# Altium project DM1092_R2M2E2.PrjPcb (part 4 of 5)

## Sheet DM1092_ESP32.SchDoc: =project_title
size Tabloid; CompanyName: Luxonis Holding; DrawnBy: David Malovrh; Organization: Luxonis Holding; Address1: 1925 Harmony Park Drive; Address2: Westminster, CO; Address3: 80234; Address4: United States; DocumentNumber: DXXXX; Revision: R2M2E2; SheetNumber: 9; SheetTotal: 12
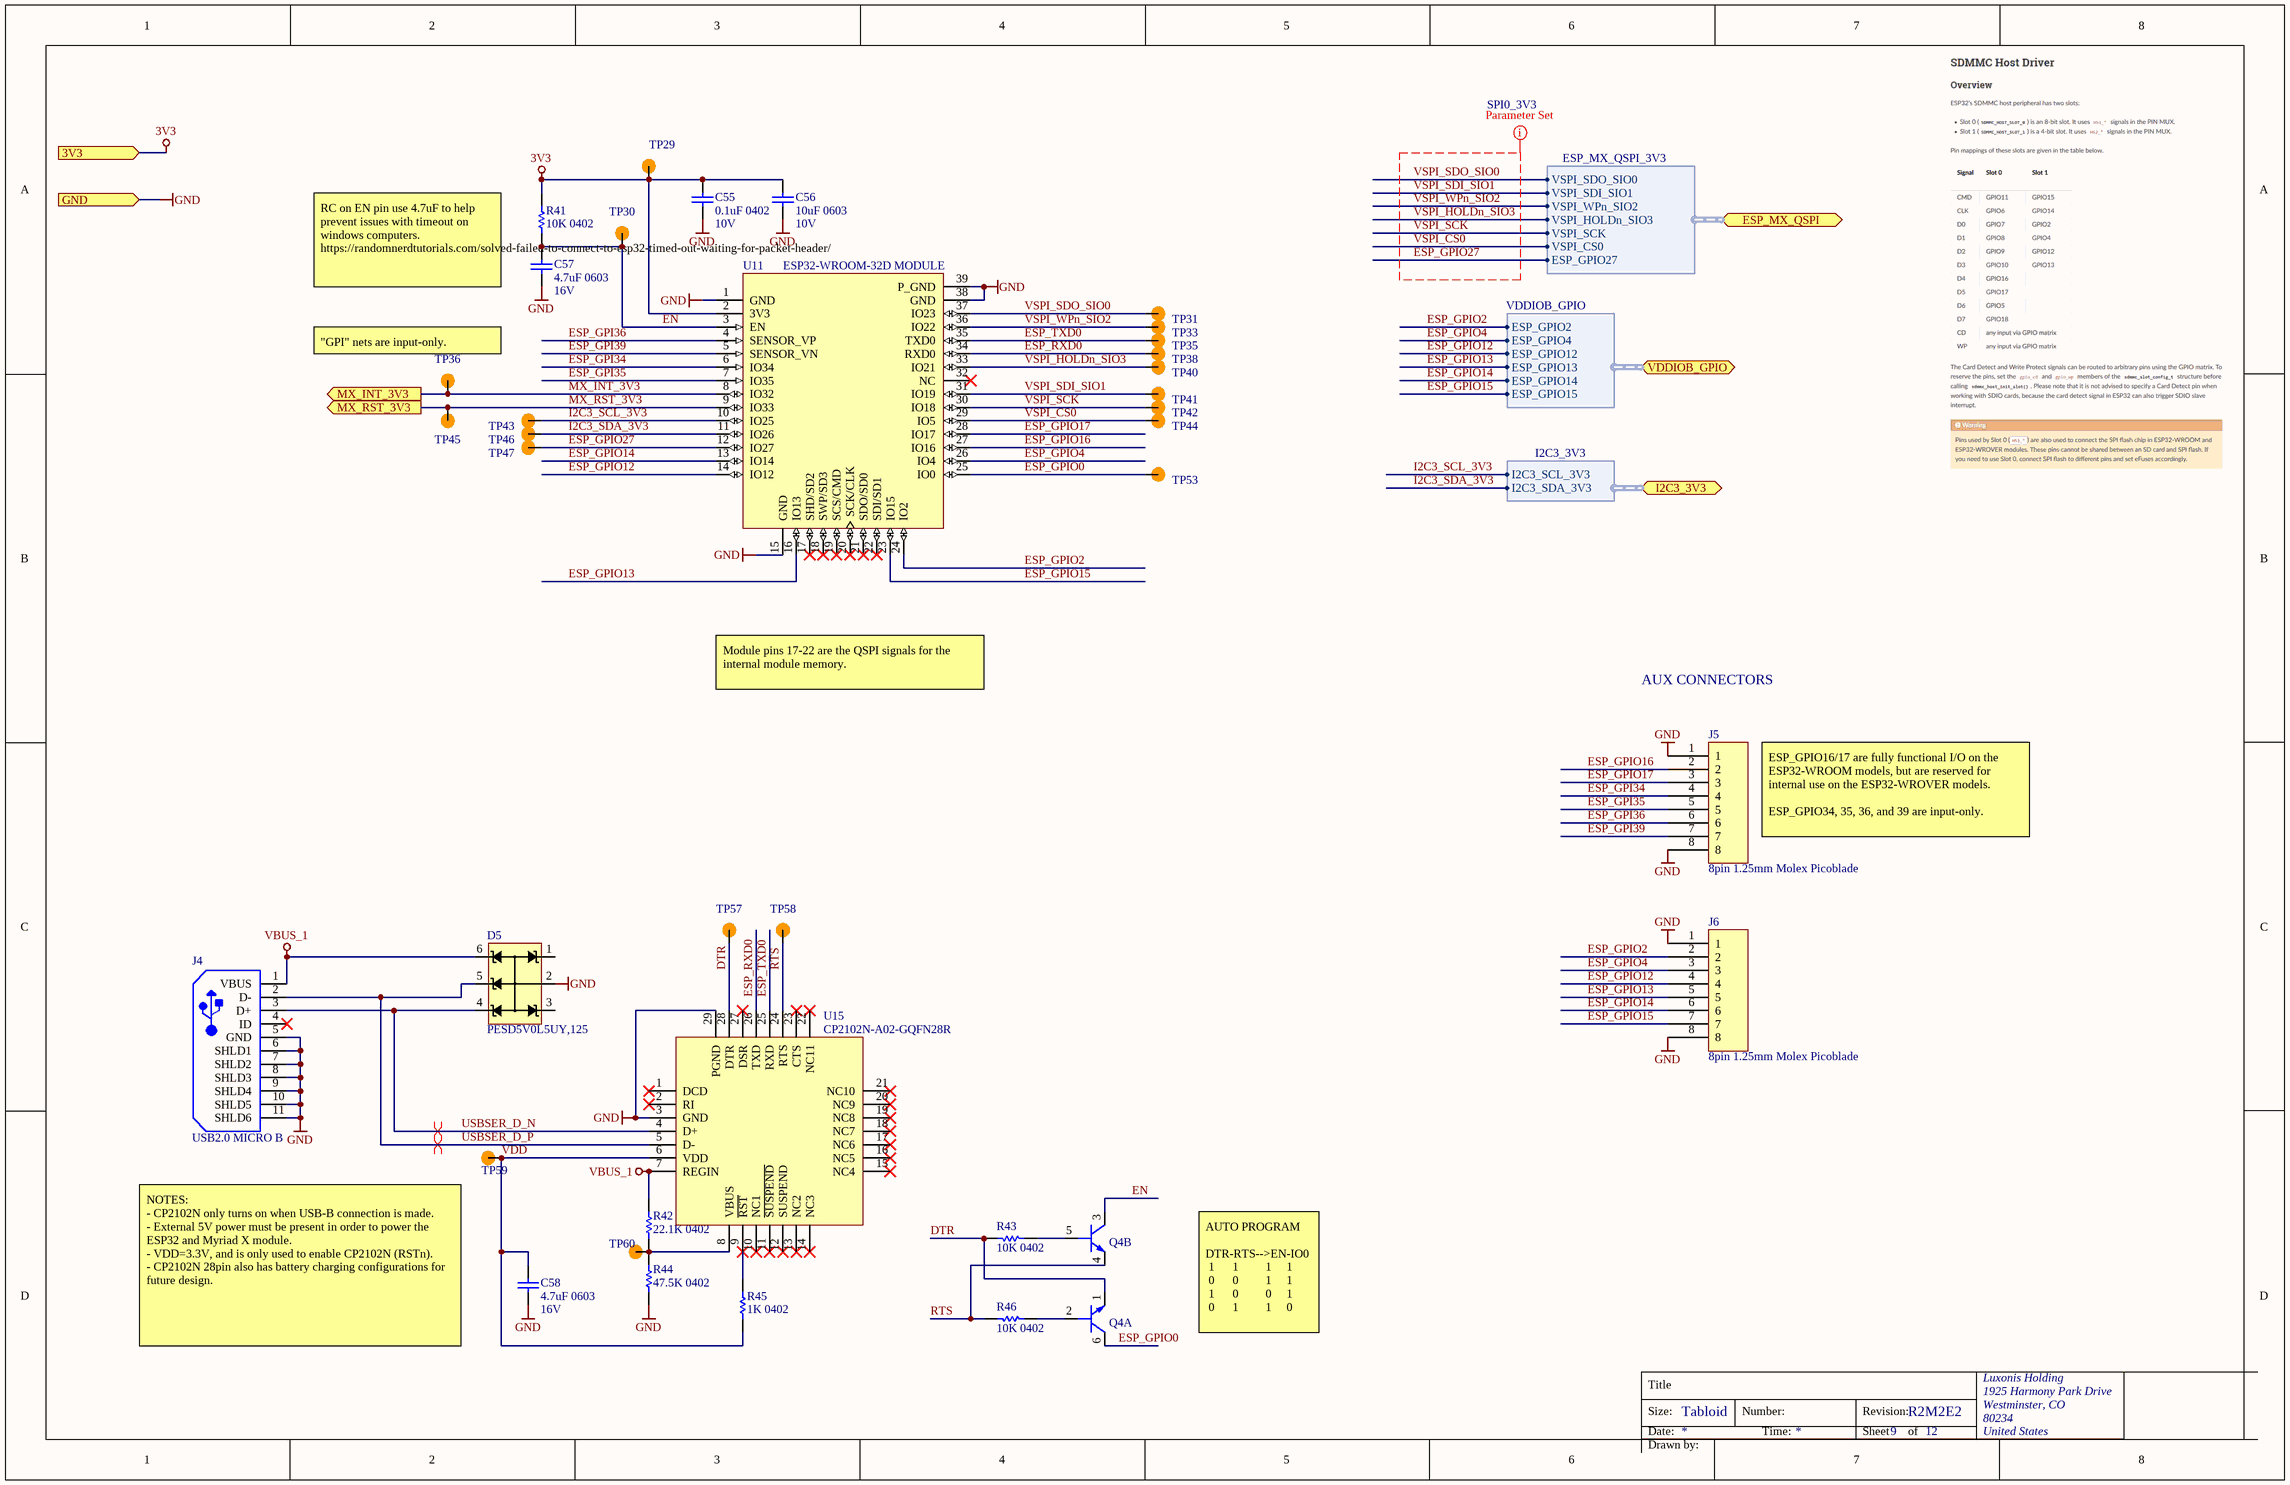
[diagram p5: DM1092_ESP32.SchDoc]

### Parts
C55  0.1uF 0402  Voltage Rating: 10V  [CAPC0402(1005)70_N]
C56  10uF 0603  Voltage Rating: 10V  [CAPC0603(1608)100_N]
C57  4.7uF 0603  Voltage Rating: 16V  [CAPC0603(1608)100_N]
C58  4.7uF 0603  Voltage Rating: 16V  [CAPC0603(1608)100_N]
D5  PESD5V0L5UY,125  [PESD5V0L5UY,125]
J4  USB2.0 MICRO B  [10118192-0001LF]
J5  8pin 1.25mm Molex Picoblade  [53047-0810]
J6  8pin 1.25mm Molex Picoblade  [53047-0810]
Q4  BC847S  [BC847S]  (value not drawn)  (parts A,B of 2)
R41  10K 0402  [RESC0402(1005)_N]
R42  22.1K 0402  [RESC0402(1005)_N]
R43  10K 0402  [RESC0402(1005)_N]
R44  47.5K 0402  [RESC0402(1005)_N]
R45  1K 0402  [RESC0402(1005)_L]
R46  10K 0402  [RESC0402(1005)_N]
TP29  TP100_200_NS  [TP100_200_NS]  (value not drawn)  (no BOM)
TP30  TP100_200_NS  [TP100_200_NS]  (value not drawn)  (no BOM)
TP31  TP100_200_NS  [TP100_200_NS]  (value not drawn)  (no BOM)
TP33  TP100_200_NS  [TP100_200_NS]  (value not drawn)  (no BOM)
TP35  TP100_200_NS  [TP100_200_NS]  (value not drawn)  (no BOM)
TP36  TP100_200_NS  [TP100_200_NS]  (value not drawn)  (no BOM)
TP38  TP100_200_NS  [TP100_200_NS]  (value not drawn)  (no BOM)
TP40  TP100_200_NS  [TP100_200_NS]  (value not drawn)  (no BOM)
TP41  TP100_200_NS  [TP100_200_NS]  (value not drawn)  (no BOM)
TP42  TP100_200_NS  [TP100_200_NS]  (value not drawn)  (no BOM)
TP43  TP100_200_NS  [TP100_200_NS]  (value not drawn)  (no BOM)
TP44  TP100_200_NS  [TP100_200_NS]  (value not drawn)  (no BOM)
TP45  TP100_200_NS  [TP100_200_NS]  (value not drawn)  (no BOM)
TP46  TP100_200_NS  [TP100_200_NS]  (value not drawn)  (no BOM)
TP47  TP100_200_NS  [TP100_200_NS]  (value not drawn)  (no BOM)
TP53  TP100_200_NS  [TP100_200_NS]  (value not drawn)  (no BOM)
TP57  TP100_200_NS  [TP100_200_NS]  (value not drawn)  (no BOM)
TP58  TP100_200_NS  [TP100_200_NS]  (value not drawn)  (no BOM)
TP59  TP100_200_NS  [TP100_200_NS]  (value not drawn)  (no BOM)
TP60  TP100_200_NS  [TP100_200_NS]  (value not drawn)  (no BOM)
U11  ESP32-WROOM-32D MODULE  [ESP32-WROOM/WROVER Combo]
U15  CP2102N-A02-GQFN28R  [CP2102N-A02-GQFN28R]

### Ports
3V3 (in), ESP_MX_QSPI (bidir, harness ESP_MX_QSPI_3V3), GND (in), I2C3_3V3 (bidir, harness I2C3_3V3), MX_INT_3V3 (out), MX_RST_3V3 (out), VDDIOB_GPIO (bidir, harness VDDIOB_GPIO)

### Harnesses
VDDIOB_GPIO: ESP_GPIO2, ESP_GPIO4, ESP_GPIO12, ESP_GPIO13, ESP_GPIO14, ESP_GPIO15
I2C3_3V3: I2C3_SCL_3V3, I2C3_SDA_3V3
ESP_MX_QSPI_3V3: VSPI_CS0, VSPI_HOLDn_SIO3, VSPI_SCK, VSPI_SDI_SIO1, VSPI_SDO_SIO0, VSPI_WPn_SIO2, ESP_GPIO27

### Nets
3V3: C55.2 C56.2 R41.2 TP29.1 U11.2(3V3) ; port 3V3
GND: C55.1 C56.1 C57.1 C58.1 D5.2 J4.5(GND) J4.6(SHLD1) J4.7(SHLD2) J4.8(SHLD3) J4.9(SHLD4) J4.10(SHLD5) J4.11(SHLD6) J5.1 J5.8 J6.1 J6.8 R44.1 U11.1(GND) U11.15(GND) U11.38(GND) U11.39(P_GND) U15.3(GND) U15.29(PGND) ; port GND
VBUS_1: D5.6 J4.1(VBUS) R42.1 U15.7(REGIN)
DTR: Q4.1(E1) R43.1 TP57.1 U15.28(DTR)
EN: C57.2 Q4.3(C2) R41.1 TP30.1 U11.3(EN)
ESP_GPI34: J5.4 U11.6(IO34)
ESP_GPI35: J5.5 U11.7(IO35)
ESP_GPI36: J5.6 U11.4(SENSOR_VP)
ESP_GPI39: J5.7 U11.5(SENSOR_VN)
ESP_GPIO0: Q4.6(C1) TP53.1 U11.25(IO0)
ESP_GPIO2: J6.2 U11.24(IO2) ; port VDDIOB_GPIO.ESP_GPIO2
ESP_GPIO4: J6.3 U11.26(IO4) ; port VDDIOB_GPIO.ESP_GPIO4
ESP_GPIO12: J6.4 U11.14(IO12) ; port VDDIOB_GPIO.ESP_GPIO12
ESP_GPIO13: J6.5 U11.16(IO13) ; port VDDIOB_GPIO.ESP_GPIO13
ESP_GPIO14: J6.6 U11.13(IO14) ; port VDDIOB_GPIO.ESP_GPIO14
ESP_GPIO15: J6.7 U11.23(IO15) ; port VDDIOB_GPIO.ESP_GPIO15
ESP_GPIO16: J5.2 U11.27(IO16)
ESP_GPIO17: J5.3 U11.28(IO17)
ESP_GPIO27: TP47.1 U11.12(IO27) ; port ESP_MX_QSPI.ESP_GPIO27
ESP_RXD0: TP38.1 U11.34(RXD0) U15.26(TXD)
ESP_TXD0: TP35.1 U11.35(TXD0) U15.25(RXD)
I2C3_SCL_3V3: TP43.1 U11.10(IO25) ; port I2C3_3V3.I2C3_SCL_3V3
I2C3_SDA_3V3: TP46.1 U11.11(IO26) ; port I2C3_3V3.I2C3_SDA_3V3
MX_INT_3V3: TP36.1 U11.8(IO32) ; port MX_INT_3V3
MX_RST_3V3: TP45.1 U11.9(IO33) ; port MX_RST_3V3
RTS: Q4.4(E2) R46.2 TP58.1 U15.24(RTS)
USBSER_D_N: D5.4 J4.3(D+) U15.4(D+)
USBSER_D_P: D5.5 J4.2(D-) U15.5(D-)
VDD: C58.2 R45.1 TP59.1 U15.6(VDD)
VSPI_CS0: TP44.1 U11.29(IO5) ; port ESP_MX_QSPI.VSPI_CS0
VSPI_HOLDn_SIO3: TP40.1 U11.33(IO21) ; port ESP_MX_QSPI.VSPI_HOLDn_SIO3
VSPI_SCK: TP42.1 U11.30(IO18) ; port ESP_MX_QSPI.VSPI_SCK
VSPI_SDI_SIO1: TP41.1 U11.31(IO19) ; port ESP_MX_QSPI.VSPI_SDI_SIO1
VSPI_SDO_SIO0: TP31.1 U11.37(IO23) ; port ESP_MX_QSPI.VSPI_SDO_SIO0
VSPI_WPn_SIO2: TP33.1 U11.36(IO22) ; port ESP_MX_QSPI.VSPI_WPn_SIO2
NetQ4_2: Q4.2(B1) R46.1
NetQ4_5: Q4.5(B2) R43.2
NetR42_2: R42.2 R44.2 TP60.1 U15.8(VBUS)
NetR45_2: R45.2 U15.9(~{RST})

Not connected (* = marked no-connect by the designer): D5 1 3; J4 4(ID)*; U11 17(SHD/SD2)* 18(SWP/SD3)* 19(SCS/CMD)* 20(SCK/CLK)* 21(SDO/SD0)* 22(SDI/SD1)* 32(NC)*; U15 1(DCD)* 2(RI)* 10(NC1)* 11(~{SUSPEND})* 12(SUSPEND)* 13(NC2)* 14(NC3)* 15(NC4)* 16(NC5)* 17(NC6)* 18(NC7)* 19(NC8)* 20(NC9)* 21(NC10)* 22(NC11)* 23(CTS)* 27(DSR)*

### Layout directives
differential pair; differential pair class USB3: USBSER_D_N, USBSER_D_P
net class SPI0_3V3; rule Matched Net Lengths [Delay Tolerance = 50ps]: ESP_GPIO27, VSPI_CS0, VSPI_HOLDn_SIO3, VSPI_SCK, VSPI_SDI_SIO1, VSPI_SDO_SIO0, VSPI_WPn_SIO2

### Notes on the sheet
- RC on EN pin use 4.7uF to help prevent issues with timeout on windows computers. https://randomnerdtutorials.com/solved-failed-to-connect-to-esp32-timed-out-waiting-for-packet-header/
- (near TP36) "GPI" nets are input-only.
- Module pins 17-22 are the QSPI signals for the internal module memory.
- AUX CONNECTORS
- ESP_GPIO16/17 are fully functional I/O on the ESP32-WROOM models, but are reserved for internal use on the ESP32-WROVER models.
  ESP_GPIO34, 35, 36, and 39 are input-only.
- (near TP59) NOTES:
  - CP2102N only turns on when USB-B connection is made.
  - External 5V power must be present in order to power the ESP32 and Myriad X module.
  - VDD=3.3V, and is only used to enable CP2102N (RSTn).
  - CP2102N 28pin also has battery charging configurations for future design.
- AUTO PROGRAM
  DTR-RTS-->EN-IO0
  1      1         1     1
  0      0         1     1
  1      0         0     1
  0      1         1     0
- Title
- Size:
- Date:
- Tabloid
- Number:
- Time:
- Revision:
- Sheet
- of
- Drawn by:

### Library data of the parts
C55 = GRM155R71A104JA01D: CAP CER 0.1UF 10V X7R 0402 5%; Manufacturer 1: Murata; Capacitance: 100nF; Supplier 1: Digi-Key; Manufacturer Part Number 1: GRM155R71A104JA01D; Stock 1: 1346709; Pricing 1: 1=0.10000, 10=0.02500, 100=0.01130, 500=0.00806, 1000=0.00633, 2500=0.00575, 5000=0.00529 (USD); RoHS: Yes; Mount: Surface Mount; Case/Package: 0402; Case Code (Imperial): 0402; Case Code (Metric): 1005; Min Operating Temperature: -55°C; Max Operating Temperature: 125°C; Tolerance: 5%; Packaging: Tape and Reel; Voltage Rating (DC): 10V; Dielectric: X7R; Package Quantity: 10000; Termination: SMD/SMT; Length: 1mm; Height: 0.5mm; Width: 0.02inch; Thickness: 0.022inch; Depth: 0.5mm; Radiation Hardening: No; Lead Free: Lead Free; ComponentLink1URL: https://datasheet.ciiva.com/5411/product-5411135.pdf?src-supplier=Mouser; ComponentLink1Description: https://datasheet.ciiva.com/5411/product-5411135.pdf?src-supplier=Mouser; ComponentLink2URL: https://datasheet.ciiva.com/11618/c02e-11618821.pdf?src-supplier=Avnet; ComponentLink2Description: https://datasheet.ciiva.com/11618/c02e-11618821.pdf?src-supplier=Avnet; Supplier Part Number 1: 490-10777-1-ND
C56 = GRM188R61A106ME69D: CAP CER 10UF 10V X5R 0603 20%; Manufacturer 1: Murata; Material: Ceramic; Supplier 1: Digi-Key; Manufacturer Part Number 1: GRM188R61A106ME69D; Stock 1: 2873098; Pricing 1: 1=0.21000, 10=0.14100, 100=0.07130, 500=0.04876, 1000=0.04313 (USD); RoHS: Yes; Mount: Surface Mount; Case/Package: 0603; Weight: 0.000222oz; Case Code (Metric): 1608; Case Code (Imperial): 0603; Min Operating Temperature: -55°C; Max Operating Temperature: 85°C; Packaging: Tape and Reel; Tolerance: 20%; Capacitance: 10uF; Dielectric: X5R; Voltage Rating (DC): 10V; Package Quantity: 4000; Termination: SMD/SMT; Length: 1.6mm; Height: 0.8mm; Width: 0.8mm; Thickness: 0.035inch; Depth: 0.8mm; REACH SVHC: Unknown; Lead Free: Lead Free; ComponentLink1URL: http://www.mouser.com/ds/2/281/c02e-2905.pdf?src-supplier=Mouser; ComponentLink1Description: http://www.mouser.com/ds/2/281/c02e-2905.pdf?src-supplier=Mouser; ComponentLink2URL: http://components.arrow.com/part/dataview/0323_06119472?src-supplier=Arrow+Europe; ComponentLink2Description: http://components.arrow.com/part/dataview/0323_06119472?src-supplier=Arrow+Europe; ComponentLink3URL: http://www.farnell.com/datasheets/2048014.pdf?src-supplier=Farnell; ComponentLink3Description: http://www.farnell.com/datasheets/2048014.pdf?src-supplier=Farnell; ComponentLink4URL: http://www.farnell.com/datasheets/1872210.pdf?src-supplier=Farnell; ComponentLink4Description: http://www.farnell.com/datasheets/1872210.pdf?src-supplier=Farnell; ComponentLink5URL: http://search.murata.co.jp/Ceramy/image/img/A01X/G101/ENG/GRM188R61A106ME69-01.pdf?src-supplier=Digi-Key; ComponentLink5Description: http://search.murata.co.jp/Ceramy/image/img/A01X/G101/ENG/GRM188R61A106ME69-01.pdf?src-supplier=Digi-Key; ComponentLink6URL: http://www.farnell.com/datasheets/1872210.pdf?src-supplier=Newark; ComponentLink6Description: http://www.farnell.com/datasheets/1872210.pdf?src-supplier=Newark; ComponentLink7URL: http://www.farnell.com/datasheets/2048014.pdf?src-supplier=Element14; ComponentLink7Description: http://www.farnell.com/datasheets/2048014.pdf?src-supplier=Element14; ComponentLink8URL: http://www.farnell.com/datasheets/2048014.pdf?src-supplier=Newark; ComponentLink8Description: http://www.farnell.com/datasheets/2048014.pdf?src-supplier=Newark; Supplier Part Number 1: 490-10475-1-ND
C57 C58 = GRM188R61C475KAAJD: CAP CER 4.7UF 16V X5R 0603 10%; Manufacturer 1: Murata; Material: Ceramic; Supplier 1: Digi-Key; Manufacturer Part Number 1: GRM188R61C475KAAJD; Stock 1: 455058; Pricing 1: 1=0.35000, 10=0.24600, 100=0.14730, 500=0.11050, 1000=0.09331 (USD); RoHS: Yes; Mount: Surface Mount; Case/Package: 0603; Case Code (Imperial): 0603; Case Code (Metric): 1608; Min Operating Temperature: -55°C; Max Operating Temperature: 85°C; Capacitance: 4.7uF; Tolerance: 10%; Packaging: Tape and Reel; Voltage Rating (DC): 16V; Dielectric: X5R; Package Quantity: 4000; Termination: SMD/SMT; Length: 1.6mm; Height: 0.8mm; Width: 0.8mm; Thickness: 0.037inch; Depth: 0.8mm; Lead Free: Lead Free; ComponentLink1URL: https://datasheet.ciiva.com/14813/595grm188r61c475kaaj23-14813668.pdf?src-supplier=Arrow; ComponentLink1Description: https://datasheet.ciiva.com/14813/595grm188r61c475kaaj23-14813668.pdf?src-supplier=Arrow; Supplier Part Number 1: 490-10481-1-ND; Weight: 0.000222oz; REACH SVHC: No SVHC; Supplier 2: Digi-Key; Manufacturer 2: Murata; Manufacturer Part Number 2: GRM188R61C475KAAJD; Stock 2: 455058; Pricing 2: 1=0.35000, 10=0.24600, 100=0.14730, 500=0.11050, 1000=0.09331 (USD); Supplier 3: Digi-Key; Manufacturer 3: Murata; Manufacturer Part Number 3: GRM188R61C475KAAJD; Stock 3: 452000; Pricing 3: 4000=0.07259, 8000=0.06832, 12000=0.06619, 28000=0.06405 (USD); Supplier Part Number 2: 490-10481-6-ND; Supplier Part Number 3: 490-10481-2-ND
D5 = PESD5V0L5UY,125: TVS DIODE 5V 12V 6TSSOP; Manufacturer 1: Nexperia; Supplier 1: Digi-Key; Manufacturer Part Number 1: PESD5V0L5UY,125; RoHS: No; Category: ESD and Circuit Protection ICs; Stock 1: 13001; Pricing 1: 1=0.36000, 10=0.27500, 25=0.24760, 100=0.13050, 250=0.12916, 500=0.11566, 1000=0.09000 (USD); ComponentLink1URL: https://www.mouser.com/ds/2/302/PESDXL5UF_V_Y-63173.pdf?src-supplier=Mouser; ComponentLink1Description: https://www.mouser.com/ds/2/302/PESDXL5UF_V_Y-63173.pdf?src-supplier=Mouser; Supplier 2: Digi-Key; Supplier 3: Arrow; Supplier 4: Mouser; Supplier Part Number 3: PESD5V0L5UY,125; Supplier Part Number 2: 1727-5798-2-ND; Supplier Part Number 1: 1727-5798-1-ND; Supplier Part Number 4: 771-PESD5V0L5UY,125
J4 = 10118192-0001LF: CONN RCPT USB2.0 MICRO B SMD R/A; Manufacturer 1: Amphenol FCI; Gender: Receptacle; Current Rating: 1.8A; Connector Type: USB,Receptacle; Number of Contacts: 5; Number of Ports: 1; Insulation Resistance: 1GR; Max Voltage Rating (AC): 100V; Pitch: 0.65mm; Supplier 1: Digi-Key; Manufacturer Part Number 1: 10118192-0001LF; RoHS: Yes; Category: USB Connectors; Stock 1: 60049; Pricing 1: 1=0.43000, 10=0.40500, 25=0.36480, 50=0.32420, 100=0.31070, 250=0.28368, 500=0.27016 (USD); Mount: Surface Mount,Horizontal; Contact Plating: Gold; Contact Material: Copper Alloy; Color: Black; Number of Terminals: 5; Housing Material: Polymer; Min Operating Temperature: -55°C; Max Operating Temperature: 85°C; Termination: Solder; Packaging: Tape and Reel; Orientation: Right Angle; Package Quantity: 1400; Features: Shielded; Voltage Rating: 100V; USB Standard: USB 2.0; Length: 7.86mm; Depth: 5.57mm; Radiation Hardening: No; Flammability Rating: UL94 V-0; Lead Free: Lead Free; REACH SVHC: No SVHC; ComponentLink1URL: https://datasheet.ciiva.com/851/10118192-851112.pdf?src-supplier=Digi-Key; ComponentLink1Description: https://datasheet.ciiva.com/851/10118192-851112.pdf?src-supplier=Digi-Key; ComponentLink2URL: https://datasheet.ciiva.com/26853/getdatasheetpartid-418041-26853891.pdf?src-supplier=Verical; ComponentLink2Description: https://datasheet.ciiva.com/26853/getdatasheetpartid-418041-26853891.pdf?src-supplier=Verical; ComponentLink3URL: https://datasheet.ciiva.com/4598/10118192ac-197249-4598796.pdf?src-supplier=Mouser; ComponentLink3Description: https://datasheet.ciiva.com/4598/10118192ac-197249-4598796.pdf?src-supplier=Mouser; Supplier 2: Digi-Key; Supplier 3: Arrow; Supplier 4: Future Electronics; Supplier Part Number 1: 609-4613-1-ND; Supplier Part Number 2: 609-4613-2-ND; Supplier Part Number 3: 10118192-0001LF; Supplier Part Number 4: 10118192-0001LF-CUTT
J5 J6 = 53047-0810: CONN HEADER VERT 8POS 1.25MM  Connector Header Through Hole 8 position 0.049" (1.25mm); Number of Contacts: 8; Contact Resistance: 20mR; Gender: Male; Current Rating: 1A; Voltage Rating: 125V; Insulation Resistance: 100MR; Glow Wire Compliant: Non-compliant; Supplier 1: Digi-Key; Manufacturer 1: Molex; Manufacturer Part Number 1: 53047-0810; Stock 1: 10707; Pricing 1: 1=0.54000, 10=0.50500, 100=0.38690, 500=0.33644, 1000=0.27756, 5000=0.24392, 10000=0.22710 (USD); RoHS: Yes; Mount: Through Hole; Case/Package: 0810; Contact Plating: Tin; Contact Material: Bronze,Brass,Tin; Color: Natural; Housing Color: Natural; Housing Material: Polyamide; Min Operating Temperature: -40°C; Max Operating Temperature: 85°C; Termination: Through Hole; Number of Rows: 1; Orientation: Vertical; Packaging: Tray; Number of Positions: 8; Package Quantity: 2000; Voltage Rating (DC): 125V; Number of Circuits: 8; Pitch: 1.25mm; Radiation Hardening: No; REACH SVHC: Unknown; Lead Free: Lead Free; Flammability Rating: UL94 V-0; ComponentLink1URL: https://datasheet.ciiva.com/30110/64290530470810-pcb-headers-30110449.pdf?src-supplier=Onlinecomponents.com; ComponentLink1Description: https://datasheet.ciiva.com/30110/64290530470810-pcb-headers-30110449.pdf?src-supplier=Onlinecomponents.com; ComponentLink2URL: https://datasheet.ciiva.com/5155/0530470810-pcb-headers-170988-5155236.pdf?src-supplier=Mouser; ComponentLink2Description: https://datasheet.ciiva.com/5155/0530470810-pcb-headers-170988-5155236.pdf?src-supplier=Mouser; ComponentLink3URL: https://datasheet.ciiva.com/11747/0900766b8024e2fd-11747012.pdf?src-supplier=RSComponents; ComponentLink3Description: https://datasheet.ciiva.com/11747/0900766b8024e2fd-11747012.pdf?src-supplier=RSComponents; ComponentLink4URL: https://datasheet.ciiva.com/25291/1815828-25291355.pdf?src-supplier=Newark; ComponentLink4Description: https://datasheet.ciiva.com/25291/1815828-25291355.pdf?src-supplier=Newark; ComponentLink5URL: https://datasheet.ciiva.com/34303/1932504-34303339.pdf?src-supplier=Jameco; ComponentLink5Description: https://datasheet.ciiva.com/34303/1932504-34303339.pdf?src-supplier=Jameco; ComponentLink6URL: https://datasheet.ciiva.com/16658/0530470810-pcb-headers-16658422.pdf?src-supplier=Avnet+Europe; ComponentLink6Description: https://datasheet.ciiva.com/16658/0530470810-pcb-headers-16658422.pdf?src-supplier=Avnet+Europe; ComponentLink7URL: https://datasheet.ciiva.com/17025/70266944-17025467.pdf?src-supplier=Allied+Electronics; ComponentLink7Description: https://datasheet.ciiva.com/17025/70266944-17025467.pdf?src-supplier=Allied+Electronics; ComponentLink8URL: https://datasheet.ciiva.com/14156/ge116819-116832-e-14156239.pdf?src-supplier=Distrelec; ComponentLink8Description: https://datasheet.ciiva.com/14156/ge116819-116832-e-14156239.pdf?src-supplier=Distrelec; Supplier 2: Mouser; Supplier Part Number 1: WM1737-ND; Supplier Part Number 2: 538-53047-0810
Q4 = BC847S: BC847S Series NPN 45 V 100 mA Silicon AF Transistor Array - SOT-363-6; Manufacturer 1: Infineon; Collector Emitter Voltage (VCEO): 45V; Max Power Dissipation: 250mW; Max Collector Current: 100mA; Collector Base Voltage (VCBO): 50V; Emitter Base Voltage (VEBO): 6V; hFE Min: 200; Collector Emitter Saturation Voltage: 600mV; Max Frequency: 250MHz; Supplier 1: Digi-Key; Manufacturer Part Number 1: BC847S; RoHS: Yes; Category: MOSFETs; Stock 1: 132000; Pricing 1: 3000=0.06565, 6000=0.05679, 15000=0.04709, 30000=0.04626, 75000=0.04155, 150000=0.03601 (USD); Case/Package: SOT; Number of Pins: 6; Max Operating Temperature: 150°C; Packaging: Tape and Reel; Polarity: NPN; Voltage: 45V; Length: 2mm; Height: 0.8mm; Width: 1.25mm; Halogen Free: Halogen Free; ComponentLink1URL: https://datasheet.ciiva.com/29323/153224-da-01-en-transistor-af-bc847s-sot-363-inf-29323690.pdf?src-supplier=Conrad; ComponentLink1Description: https://datasheet.ciiva.com/29323/153224-da-01-en-transistor-af-bc847s-sot-363-inf-29323690.pdf?src-supplier=Conrad; Supplier 2: Digi-Key; Supplier 3: Future Electronics; Supplier 4: Mouser; Supplier Part Number 1: BC847SH6327XTSA1TR-ND; Supplier Part Number 3: BC847SH6327XTSA1-REEL; Supplier Part Number 4: 726-BC847SH6327; Supplier Part Number 2: BC847SH6327XTSA1CT-ND
R41 R43 R46 = RC0402FR-1310KL: RES SMD 10K OHM 1% 0402 1/16W Chip Resistor, 0402 [1005 Metric], 10 kohm, RC Series, 50 V, Thick Film, 62.5 mW; Manufacturer 1: Yageo; Resistance: 10kR; Temperature Coefficient: 100ppm/°C; Power Rating: 62.5mW; Voltage Rating: 50V; ComponentLink1URL: https://datasheet.ciiva.com/16940/pyu-rc0402-51-rohs-l-6-16940293.pdf?src-supplier=Avnet+Europe; ComponentLink1Description: https://datasheet.ciiva.com/16940/pyu-rc0402-51-rohs-l-6-16940293.pdf?src-supplier=Avnet+Europe; ComponentLink2URL: https://datasheet.ciiva.com/28386/pyu-rc0402-51-rohs-l-6-28386855.pdf?src-supplier=Avnet+Europe; ComponentLink2Description: https://datasheet.ciiva.com/28386/pyu-rc0402-51-rohs-l-6-28386855.pdf?src-supplier=Avnet+Europe; ComponentLink3URL: https://datasheet.ciiva.com/16740/pyu-rc0402-51-rohs-l-6-r-16740602.pdf?src-supplier=Future+Electronics; ComponentLink3Description: https://datasheet.ciiva.com/16740/pyu-rc0402-51-rohs-l-6-r-16740602.pdf?src-supplier=Future+Electronics; ComponentLink4URL: https://datasheet.ciiva.com/8891/pyu-rc0402-51-rohs-l-6-8891339.pdf?src-supplier=Avnet; ComponentLink4Description: https://datasheet.ciiva.com/8891/pyu-rc0402-51-rohs-l-6-8891339.pdf?src-supplier=Avnet; ComponentLink5URL: https://datasheet.ciiva.com/5557/pyu-rc0402-51-rohs-l-6-r-5557997.pdf?src-supplier=Mouser; ComponentLink5Description: https://datasheet.ciiva.com/5557/pyu-rc0402-51-rohs-l-6-r-5557997.pdf?src-supplier=Mouser; ComponentLink6URL: https://datasheet.ciiva.com/7983/1018594-7983533.pdf?src-supplier=Element14; ComponentLink6Description: https://datasheet.ciiva.com/7983/1018594-7983533.pdf?src-supplier=Element14; Supplier 1: Newark; Manufacturer Part Number 1: RC0402FR-1310KL; Stock 1: 62239; Pricing 1: 1=0.10000, 25=0.01200, 100=0.00400, 250=0.00400, 500=0.00300, 1000=0.00300 (USD); RoHS: Yes; Case/Package: 0402; Number of Pins: 2; Contact Plating: Tin,Matte,Lead; Case Code (Imperial): 0402; Case Code (Metric): 1005; Min Operating Temperature: -55°C; Max Operating Temperature: 155°C; Tolerance: 1%; Composition: Thick Film; Packaging: Tape and Reel; Termination: SMD/SMT; Military Standard: Not; Voltage Rating (DC): 50V; Working Voltage: 50V; Number of Terminations: 2; Length: 1mm; Depth: 0.5mm; Radiation Hardening: No; REACH SVHC: No SVHC; Lead Free: Lead Free; Supplier Part Number 1: 67R9960; Supplier 2: Future Electronics; Supplier 3: Mouser; Supplier 4: Element14; Supplier Part Number 2: RC0402FR-1310KL-CUTT; Supplier Part Number 3: 603-RC0402FR-1310KL; Supplier Part Number 4: 1799235
R42 = RC0402FR-0722K1L: RES SMD 22.1K OHM 1% 1/16W 0402; Manufacturer 1: Yageo; Resistance: 22.1kR; Temperature Coefficient: 100ppm/°C; Power Rating: 62.5mW; Max Power Dissipation: 63mW; Voltage Rating (DC): 50V; Supplier 1: Digi-Key; Manufacturer Part Number 1: RC0402FR-0722K1L; RoHS: Yes; Category: Chip SMD Resistors; Stock 1: 22819; Pricing 1: 1=0.10000, 10=0.01600, 100=0.00640, 1000=0.00289, 2500=0.00251, 5000=0.00207 (USD); Case/Package: 0402; Case Code (Metric): 1005; Case Code (Imperial): 0402; Min Operating Temperature: -55°C; Max Operating Temperature: 155°C; Tolerance: 1%; Packaging: Tape and Reel; Composition: Thick Film; Number of Terminations: 2; Package Quantity: 1; Voltage Rating: 50V; Termination: SMD/SMT; Features: Moisture Resistant; Military Standard: Not; Working Voltage: 50V; Length: 1mm; Height: 0.016inch; Width: 0.02inch; Depth: 0.5mm; Lead Free: Lead Free; REACH SVHC: No SVHC; ComponentLink1URL: https://datasheet.ciiva.com/2553/pyu-r-int-thick-7-2553200.pdf?src-supplier=Digi-Key; ComponentLink1Description: https://datasheet.ciiva.com/2553/pyu-r-int-thick-7-2553200.pdf?src-supplier=Digi-Key; ComponentLink2URL: https://datasheet.ciiva.com/2553/pyu-r-int-thick-7-2553201.pdf?src-supplier=Digi-Key; ComponentLink2Description: https://datasheet.ciiva.com/2553/pyu-r-int-thick-7-2553201.pdf?src-supplier=Digi-Key; ComponentLink3URL: https://datasheet.ciiva.com/2553/pyu-r-int-thick-7-2553202.pdf?src-supplier=Digi-Key; ComponentLink3Description: https://datasheet.ciiva.com/2553/pyu-r-int-thick-7-2553202.pdf?src-supplier=Digi-Key; ComponentLink4URL: https://datasheet.ciiva.com/15189/getdatasheetpartid-251817-15189388.pdf?src-supplier=Verical; ComponentLink4Description: https://datasheet.ciiva.com/15189/getdatasheetpartid-251817-15189388.pdf?src-supplier=Verical; ComponentLink5URL: https://datasheet.ciiva.com/7983/1018594-7983501.pdf?src-supplier=Element14; ComponentLink5Description: https://datasheet.ciiva.com/7983/1018594-7983501.pdf?src-supplier=Element14; Supplier 2: Digi-Key; Supplier 3: Future Electronics; Supplier 4: Mouser; Supplier Part Number 1: 311-22.1KLRCT-ND; Supplier Part Number 2: 311-22.1KLRTR-ND; Supplier Part Number 3: RC0402FR-0722K1L-CUTT; Supplier Part Number 4: 603-RC0402FR-0722K1L
R44 = RC0402FR-0747K5L: RES SMD 47.5K OHM 1% 1/16W 0402; Manufacturer 1: Yageo; Resistance: 47.5kR; Temperature Coefficient: 100ppm/°C; Power Rating: 62.5mW; Voltage Rating: 50V; Supplier 1: Digi-Key; Manufacturer Part Number 1: RC0402FR-0747K5L; RoHS: Yes; Category: Chip SMD Resistors; Stock 1: 9750; Pricing 1: 1=0.10000, 10=0.01600, 100=0.00640, 1000=0.00289, 2500=0.00251, 5000=0.00207 (USD); Case/Package: 0402; Case Code (Imperial): 0402; Case Code (Metric): 1005; Min Operating Temperature: -55°C; Max Operating Temperature: 155°C; Tolerance: 1%; Packaging: Tape and Reel; Composition: Thick Film; Voltage Rating (DC): 50V; Termination: SMD/SMT; Military Standard: Not; Length: 1mm; Depth: 0.5mm; Lead Free: Lead Free; REACH SVHC: No SVHC; ComponentLink1URL: https://datasheet.ciiva.com/16746/pyu-rc0402-51-rohs-l-6-r-16746316.pdf?src-supplier=Future+Electronics; ComponentLink1Description: https://datasheet.ciiva.com/16746/pyu-rc0402-51-rohs-l-6-r-16746316.pdf?src-supplier=Future+Electronics; ComponentLink2URL: https://datasheet.ciiva.com/46394/1018594-46394942.pdf?src-supplier=Element14; ComponentLink2Description: https://datasheet.ciiva.com/46394/1018594-46394942.pdf?src-supplier=Element14; ComponentLink3URL: https://datasheet.ciiva.com/12667/pyu-rc0402-51-rohs-l-6-r-12667103.pdf?src-supplier=Mouser; ComponentLink3Description: https://datasheet.ciiva.com/12667/pyu-rc0402-51-rohs-l-6-r-12667103.pdf?src-supplier=Mouser; Supplier 2: Mouser; Supplier 3: Verical; Supplier 4: Arrow; Supplier Part Number 4: RC0402FR-0747K5L; Supplier Part Number 3: RC0402FR-0747K5L; Supplier Part Number 2: 603-RC0402FR-0747K5L; Supplier Part Number 1: 311-47.5KLRCT-ND
R45 = RC0402FR-071KL: RES SMD 1K OHM 1% 1/16W 0402 1 kOhms ±1% 0.063W, 1/16W Chip Resistor 0402 (1005 Metric) Moisture Resistant Thick Film; Manufacturer 1: Yageo; Temperature Coefficient: 100ppm/°C; Power Rating: 62.5mW; Voltage Rating (DC): 50V; Resistance: 1kR; RoHS: Yes; Number of Pins: 2; Case Code (Imperial): 0402; Case Code (Metric): 1005; Min Operating Temperature: -55°C; Max Operating Temperature: 155°C; Packaging: Tape and Reel; Composition: Thick Film; Voltage Rating: 50V; Military Standard: Not; Termination: SMD/SMT; Length: 1mm; Height: 0.32mm; Width: 0.5mm; Depth: 0.5mm; Lead Free: Lead Free; REACH SVHC: Unknown; ComponentLink1URL: https://datasheet.ciiva.com/11819/0900766b80c66297-11819477.pdf?src-supplier=RSComponents; ComponentLink1Description: https://datasheet.ciiva.com/11819/0900766b80c66297-11819477.pdf?src-supplier=RSComponents; ComponentLink2URL: https://datasheet.ciiva.com/12666/pyu-rc0402-51-rohs-l-6-r-12666741.pdf?src-supplier=Mouser; ComponentLink2Description: https://datasheet.ciiva.com/12666/pyu-rc0402-51-rohs-l-6-r-12666741.pdf?src-supplier=Mouser; ComponentLink3URL: https://datasheet.ciiva.com/17063/pyu-rc0402-51-rohs-l-6-r-17063193.pdf?src-supplier=Future+Electronics; ComponentLink3Description: https://datasheet.ciiva.com/17063/pyu-rc0402-51-rohs-l-6-r-17063193.pdf?src-supplier=Future+Electronics; ComponentLink4URL: https://datasheet.ciiva.com/22747/1018594-22747513.pdf?src-supplier=Element14; ComponentLink4Description: https://datasheet.ciiva.com/22747/1018594-22747513.pdf?src-supplier=Element14; ComponentLink5URL: https://datasheet.ciiva.com/7849/1018594-7849869.pdf?src-supplier=Element14; ComponentLink5Description: https://datasheet.ciiva.com/7849/1018594-7849869.pdf?src-supplier=Element14; ComponentLink6URL: https://datasheet.ciiva.com/7983/1018594-7983502.pdf?src-supplier=Element14; ComponentLink6Description: https://datasheet.ciiva.com/7983/1018594-7983502.pdf?src-supplier=Element14; ComponentLink7URL: https://datasheet.ciiva.com/7849/1018594-7849871.pdf?src-supplier=Element14; ComponentLink7Description: https://datasheet.ciiva.com/7849/1018594-7849871.pdf?src-supplier=Element14; Supplier 1: Digi-Key; Manufacturer Part Number 1: RC0402FR-071KL; Stock 1: 60695854; Pricing 1: 1=0.10000, 10=0.01600, 100=0.00670, 1000=0.00301, 2500=0.00261, 5000=0.00215 (USD); Case/Package: 0402; Tolerance: 1%; Supplier Part Number 1: 311-1.00KLRCT-ND
TP29-TP31 TP33 TP35 TP36 TP38 TP40-TP47 TP53 TP57-TP60 = TEST_POINT
U11 = ESP32-WROOM-32D: ESP32-WROOM-32D MODULE: Wi-Fi/BT BLE, ESP32-D0WD, SPI Flash, UART, P; Manufacturer 1: Espressif Systems; Frequency: 2.5GHz; Data Rate: 150Mbps; Sensitivity: -98dBm; Interface: I2C,SPI,GPIO,PWM,SDIO,UART; Memory Size: 536KB; Supplier 1: Digi-Key; Manufacturer Part Number 1: ESP32-WROOM-32D; RoHS: Yes; Category: RF Receivers, Transceivers; Stock 1: 2394; Pricing 1: 1=3.80000 (USD); Mount: Surface Mount; Case/Package: SMD/SMT; Min Operating Temperature: -40°C; Max Operating Temperature: 85°C; Packaging: Cut Tape; ComponentLink1URL: https://www.espressif.com/sites/default/files/documentation/esp32-wroom-32d_esp32-wroom-32u_datasheet_en.pdf?src-supplier=Digi-Key; ComponentLink1Description: https://www.espressif.com/sites/default/files/documentation/esp32-wroom-32d_esp32-wroom-32u_datasheet_en.pdf?src-supplier=Digi-Key; Supplier 2: Mouser; Supplier 3: Arrow; Supplier Part Number 3: ESP32-WROOM-32D; Supplier Part Number 2: 356-ESP32WROOM-32D; Supplier Part Number 1: 1904-1023-1-ND
U15 = CP2102N-A02-GQFN28R: IC USB TO UART BRIDGE QFN28; Manufacturer 1: Silicon Labs; Supplier 1: Digi-Key; Manufacturer Part Number 1: CP2102N-A02-GQFN28R; RoHS: Yes; Stock 1: 3731; Pricing 1: 1=1.40000, 25=1.35160, 100=1.29950 (USD); Supplier 2: Digi-Key; Supplier 3: Mouser; Supplier 4: Verical; Supplier Part Number 1: 336-5890-1-ND; Supplier Part Number 2: 336-5890-2-ND; Supplier Part Number 3: 634-CP2102NA02QFN28R; Supplier Part Number 4: CP2102N-A02-GQFN28R

## Sheet DM1092_IMU.SchDoc: =project_title
size Tabloid; CompanyName: Luxonis Holding; DrawnBy: David Malovrh; Organization: Luxonis Holding; Address1: 1925 Harmony Park Drive; Address2: Westminster, CO; Address3: 80234; Address4: United States; DocumentNumber: DXXXX; Revision: R2M2E2; SheetNumber: 10; SheetTotal: 12
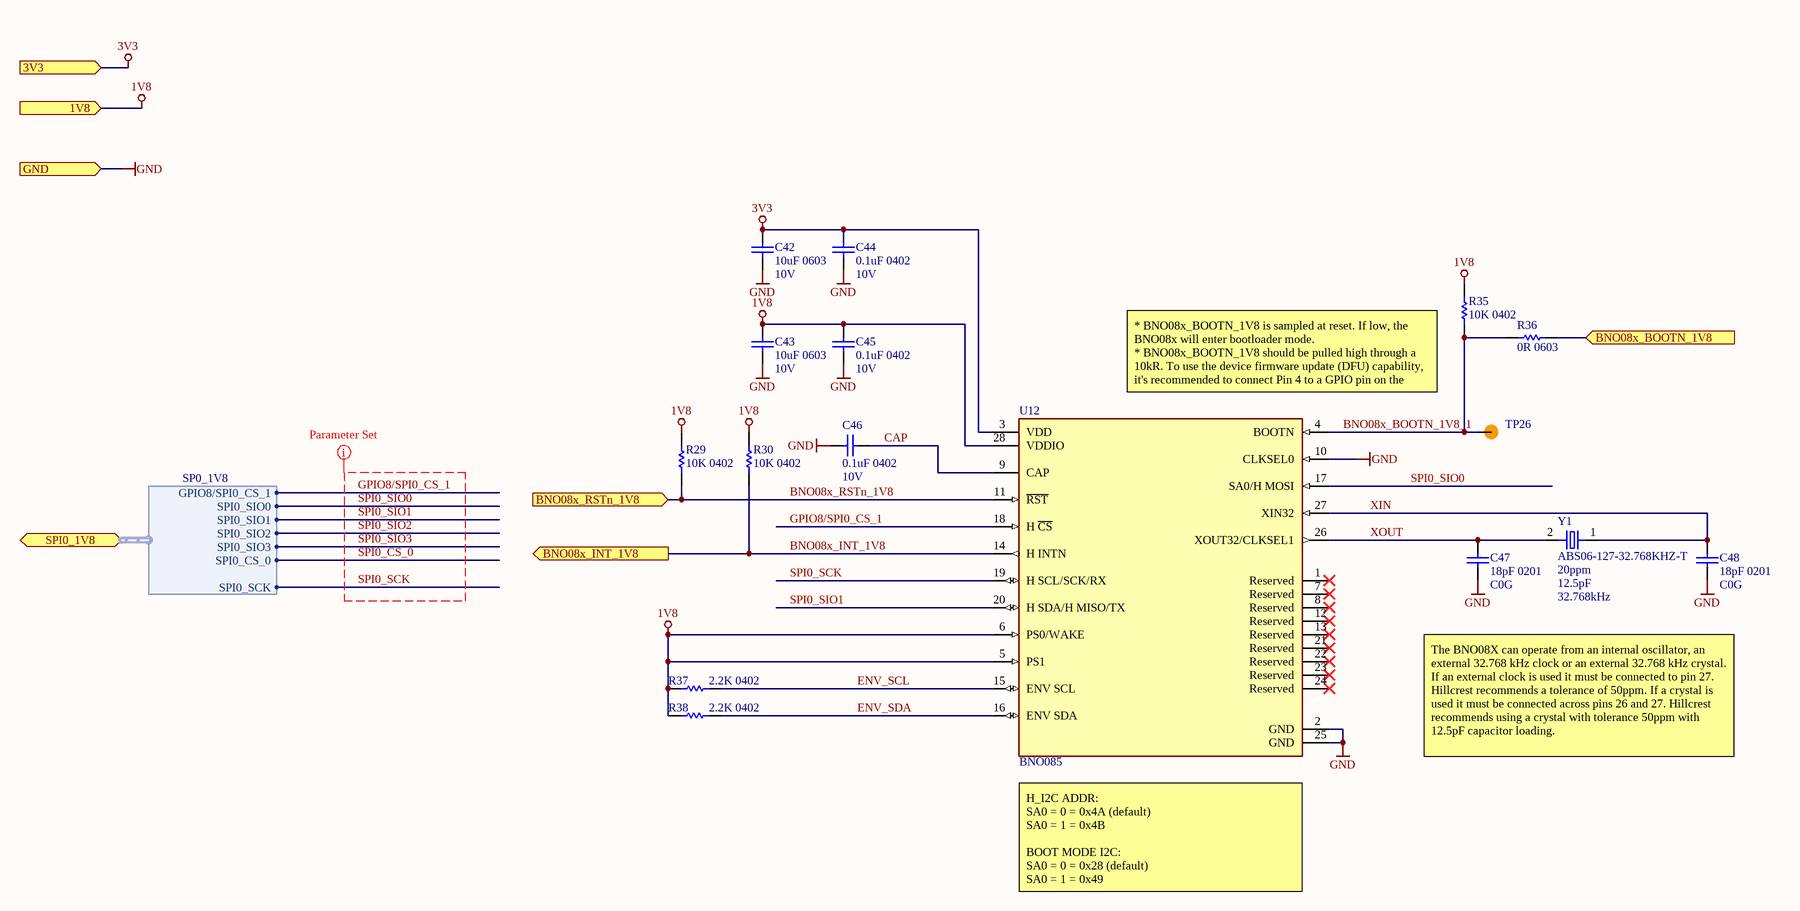
[diagram p6: DM1092_IMU.SchDoc]

### Parts
C42  10uF 0603  Voltage Rating: 10V  [CAPC0603(1608)100_N]
C43  10uF 0603  Voltage Rating: 10V  [CAPC0603(1608)100_N]
C44  0.1uF 0402  Voltage Rating: 10V  [CAPC0402(1005)70_N]
C45  0.1uF 0402  Voltage Rating: 10V  [CAPC0402(1005)70_N]
C46  0.1uF 0402  Voltage Rating: 10V  [CAPC0402(1005)70_N]
C47  18pF 0201  Dielectric: C0G  [CAPC0201(0603)33_N]
C48  18pF 0201  Dielectric: C0G  [CAPC0201(0603)33_N]
R29  10K 0402  [RESC0402(1005)_N]
R30  10K 0402  [RESC0402(1005)_N]
R35  10K 0402  [RESC0402(1005)_N]
R36  0R 0603  [RESC0603(1608)_N]
R37  2.2K 0402  [RESC0402(1005)_N]
R38  2.2K 0402  [RESC0402(1005)_N]
TP26  TP100_200_NS  [TP100_200_NS]  (value not drawn)  (no BOM)
U12  BNO085  [BNO085]
Y1  ABS06-127-32.768KHZ-T  Frequency Tolerance: 20ppm  Load Capacitance: 12.5pF  Frequency: 32.768kHz  [ABS06-127-32.768KHZ-T]

### Ports
1V8 (in), 3V3 (in), BNO08x_BOOTN_1V8 (in), BNO08x_INT_1V8 (out), BNO08x_RSTn_1V8 (in), GND (in), SPI0_1V8 (bidir, harness SP0_1V8)

### Harnesses
SP0_1V8: SPI0_SIO1, SPI0_SIO2, SPI0_SIO3, GPIO8/SPI0_CS_1, SPI0_SIO0, SPI0_CS_0, SPI0_SCK

### Nets
1V8: C43.2 C45.2 R29.2 R30.2 R35.2 R37.1 R38.1 U12.5(PS1) U12.6(PS0/WAKE) U12.28(VDDIO) ; port 1V8
3V3: C42.2 C44.2 U12.3(VDD) ; port 3V3
GND: C42.1 C43.1 C44.1 C45.1 C46.2 C47.1 C48.1 U12.2(GND) U12.10(CLKSEL0) U12.25(GND) ; port GND
BNO08x_BOOTN_1V8_1: R35.1 R36.1 TP26.1 U12.4(BOOTN)
BNO08x_INT_1V8: R30.1 U12.14(H_INTN) ; port BNO08x_INT_1V8
BNO08x_RSTn_1V8: R29.1 U12.11(~{RST}) ; port BNO08x_RSTn_1V8
CAP: C46.1 U12.9(CAP)
ENV_SCL: R37.2 U12.15(ENV_SCL)
ENV_SDA: R38.2 U12.16(ENV_SDA)
GPIO8/SPI0_CS_1: U12.18(H_~{CS}) ; port SPI0_1V8.GPIO8/SPI0_CS_1
SPI0_SCK: U12.19(H_SCL/SCK/RX) ; port SPI0_1V8.SPI0_SCK
SPI0_SIO0: U12.17(SA0/H_MOSI) ; port SPI0_1V8.SPI0_SIO0
SPI0_SIO1: U12.20(H_SDA/H_MISO/TX) ; port SPI0_1V8.SPI0_SIO1
XIN: C48.2 U12.27(XIN32) Y1.1
XOUT: C47.2 U12.26(XOUT32/CLKSEL1) Y1.2
NetJ1_4: R36.2 ; port BNO08x_BOOTN_1V8

Not connected (* = marked no-connect by the designer): U12 1(Reserved)* 7(Reserved)* 8(Reserved)* 12(Reserved)* 13(Reserved)* 21(Reserved)* 22(Reserved)* 23(Reserved)* 24(Reserved)*

### Layout directives
net class SPI0: GPIO8/SPI0_CS_1, SPI0_CS_0, SPI0_SCK, SPI0_SIO0, SPI0_SIO1, SPI0_SIO2, SPI0_SIO3

### Notes on the sheet
- * BNO08x_BOOTN_1V8 is sampled at reset. If low, the BNO08x will enter bootloader mode.
  * BNO08x_BOOTN_1V8 should be pulled high through a 10kR. To use the device firmware update (DFU) capability, it's recommended to connect Pin 4 to a GPIO pin on the external uC.
- The BNO08X can operate from an internal oscillator, an external 32.768 kHz clock or an external 32.768 kHz crystal. If an external clock is used it must be connected to pin 27. Hillcrest recommends a tolerance of 50ppm. If a crystal is used it must be connected across pins 26 and 27. Hillcrest recommends using a crystal with tolerance 50ppm with 12.5pF capacitor loading.
- (near U12) H_I2C ADDR:
  SA0 = 0 = 0x4A (default)
  SA0 = 1 = 0x4B
  BOOT MODE I2C:
  SA0 = 0 = 0x28 (default)
  SA0 = 1 = 0x49
- Title
- Size:
- Date:
- Tabloid
- Number:
- Time:
- Revision:
- Sheet
- of
- Drawn by:

### Library data of the parts
C42 C43 = GRM188R61A106ME69D: as C56 on sheet DM1092_ESP32; Supplier 1: Digi-Key; Manufacturer Part Number 1: GRM188R61A106ME69D; Stock 1: 2873098; Pricing 1: 1=0.21000, 10=0.14100, 100=0.07130, 500=0.04876, 1000=0.04313 (USD); RoHS: Yes; Mount: Surface Mount; Case/Package: 0603; Weight: 0.000222oz; Case Code (Metric): 1608; Case Code (Imperial): 0603; Min Operating Temperature: -55°C; Max Operating Temperature: 85°C; Packaging: Tape and Reel; Tolerance: 20%; Capacitance: 10uF; Dielectric: X5R; Voltage Rating (DC): 10V; Package Quantity: 4000; Termination: SMD/SMT; Length: 1.6mm; Height: 0.8mm; Width: 0.8mm; Thickness: 0.035inch; Depth: 0.8mm; REACH SVHC: Unknown; Lead Free: Lead Free; ComponentLink1URL: http://www.mouser.com/ds/2/281/c02e-2905.pdf?src-supplier=Mouser; ComponentLink1Description: http://www.mouser.com/ds/2/281/c02e-2905.pdf?src-supplier=Mouser; ComponentLink2URL: http://components.arrow.com/part/dataview/0323_06119472?src-supplier=Arrow+Europe; ComponentLink2Description: http://components.arrow.com/part/dataview/0323_06119472?src-supplier=Arrow+Europe; ComponentLink3URL: http://www.farnell.com/datasheets/2048014.pdf?src-supplier=Farnell; ComponentLink3Description: http://www.farnell.com/datasheets/2048014.pdf?src-supplier=Farnell; ComponentLink4URL: http://www.farnell.com/datasheets/1872210.pdf?src-supplier=Farnell; ComponentLink4Description: http://www.farnell.com/datasheets/1872210.pdf?src-supplier=Farnell; ComponentLink5URL: http://search.murata.co.jp/Ceramy/image/img/A01X/G101/ENG/GRM188R61A106ME69-01.pdf?src-supplier=Digi-Key; ComponentLink5Description: http://search.murata.co.jp/Ceramy/image/img/A01X/G101/ENG/GRM188R61A106ME69-01.pdf?src-supplier=Digi-Key; ComponentLink6URL: http://www.farnell.com/datasheets/1872210.pdf?src-supplier=Newark; ComponentLink6Description: http://www.farnell.com/datasheets/1872210.pdf?src-supplier=Newark; ComponentLink7URL: http://www.farnell.com/datasheets/2048014.pdf?src-supplier=Element14; ComponentLink7Description: http://www.farnell.com/datasheets/2048014.pdf?src-supplier=Element14; ComponentLink8URL: http://www.farnell.com/datasheets/2048014.pdf?src-supplier=Newark; ComponentLink8Description: http://www.farnell.com/datasheets/2048014.pdf?src-supplier=Newark; Supplier Part Number 1: 490-10475-1-ND
C44-C46 = GRM155R71A104JA01D: as C55 on sheet DM1092_ESP32; Supplier 1: Digi-Key; Manufacturer Part Number 1: GRM155R71A104JA01D; Stock 1: 1346709; Pricing 1: 1=0.10000, 10=0.02500, 100=0.01130, 500=0.00806, 1000=0.00633, 2500=0.00575, 5000=0.00529 (USD); RoHS: Yes; Mount: Surface Mount; Case/Package: 0402; Case Code (Imperial): 0402; Case Code (Metric): 1005; Min Operating Temperature: -55°C; Max Operating Temperature: 125°C; Tolerance: 5%; Packaging: Tape and Reel; Voltage Rating (DC): 10V; Dielectric: X7R; Package Quantity: 10000; Termination: SMD/SMT; Length: 1mm; Height: 0.5mm; Width: 0.02inch; Thickness: 0.022inch; Depth: 0.5mm; Radiation Hardening: No; Lead Free: Lead Free; ComponentLink1URL: https://datasheet.ciiva.com/5411/product-5411135.pdf?src-supplier=Mouser; ComponentLink1Description: https://datasheet.ciiva.com/5411/product-5411135.pdf?src-supplier=Mouser; ComponentLink2URL: https://datasheet.ciiva.com/11618/c02e-11618821.pdf?src-supplier=Avnet; ComponentLink2Description: https://datasheet.ciiva.com/11618/c02e-11618821.pdf?src-supplier=Avnet; Supplier Part Number 1: 490-10777-1-ND
C47 C48 = GRM0335C1E180FA01D: Cap Ceramic 18pF 25V C0G 1% Pad SMD 0201 125C T/R; Manufacturer 1: Murata; Supplier 1: Digi-Key; Manufacturer Part Number 1: GRM0335C1E180FA01D; RoHS: Yes; Category: Ceramic Capacitors; Stock 1: 27511; Pricing 1: 1=0.10000, 10=0.02100, 100=0.00930, 500=0.00666, 1000=0.00523, 2500=0.00476, 5000=0.00438 (USD); Mount: Surface Mount; Case/Package: 0201; Case Code (Imperial): 0201; Case Code (Metric): 0603; Min Operating Temperature: -55°C; Max Operating Temperature: 125°C; Capacitance: 18pF; Tolerance: 1%; Packaging: Tape and Reel; Voltage Rating (DC): 25V; Package Quantity: 15000; Voltage Rating: 25V; Termination: SMD/SMT; Length: 0.024inch; Height: 0.3mm; Thickness: 0.013inch; Width: 0.3mm; ComponentLink1URL: https://datasheet.ciiva.com/29538/partnumbering-e-01-29538328.pdf?src-supplier=Digi-Key; ComponentLink1Description: https://datasheet.ciiva.com/29538/partnumbering-e-01-29538328.pdf?src-supplier=Digi-Key; Supplier 2: Digi-Key; Supplier 3: Mouser; Supplier Part Number 3: 81-GRM0335C1E180FA1D; Supplier Part Number 2: 490-17804-2-ND; Supplier Part Number 1: 490-17804-1-ND
R29 R30 R35 = RC0402FR-1310KL: as R41 on sheet DM1092_ESP32; ComponentLink1URL: https://datasheet.ciiva.com/16940/pyu-rc0402-51-rohs-l-6-16940293.pdf?src-supplier=Avnet+Europe; ComponentLink1Description: https://datasheet.ciiva.com/16940/pyu-rc0402-51-rohs-l-6-16940293.pdf?src-supplier=Avnet+Europe; ComponentLink2URL: https://datasheet.ciiva.com/28386/pyu-rc0402-51-rohs-l-6-28386855.pdf?src-supplier=Avnet+Europe; ComponentLink2Description: https://datasheet.ciiva.com/28386/pyu-rc0402-51-rohs-l-6-28386855.pdf?src-supplier=Avnet+Europe; ComponentLink3URL: https://datasheet.ciiva.com/16740/pyu-rc0402-51-rohs-l-6-r-16740602.pdf?src-supplier=Future+Electronics; ComponentLink3Description: https://datasheet.ciiva.com/16740/pyu-rc0402-51-rohs-l-6-r-16740602.pdf?src-supplier=Future+Electronics; ComponentLink4URL: https://datasheet.ciiva.com/8891/pyu-rc0402-51-rohs-l-6-8891339.pdf?src-supplier=Avnet; ComponentLink4Description: https://datasheet.ciiva.com/8891/pyu-rc0402-51-rohs-l-6-8891339.pdf?src-supplier=Avnet; ComponentLink5URL: https://datasheet.ciiva.com/5557/pyu-rc0402-51-rohs-l-6-r-5557997.pdf?src-supplier=Mouser; ComponentLink5Description: https://datasheet.ciiva.com/5557/pyu-rc0402-51-rohs-l-6-r-5557997.pdf?src-supplier=Mouser; ComponentLink6URL: https://datasheet.ciiva.com/7983/1018594-7983533.pdf?src-supplier=Element14; ComponentLink6Description: https://datasheet.ciiva.com/7983/1018594-7983533.pdf?src-supplier=Element14; Supplier 1: Newark; Manufacturer Part Number 1: RC0402FR-1310KL; Stock 1: 62239; Pricing 1: 1=0.10000, 25=0.01200, 100=0.00400, 250=0.00400, 500=0.00300, 1000=0.00300 (USD); RoHS: Yes; Case/Package: 0402; Number of Pins: 2; Contact Plating: Tin,Matte,Lead; Case Code (Imperial): 0402; Case Code (Metric): 1005; Min Operating Temperature: -55°C; Max Operating Temperature: 155°C; Tolerance: 1%; Composition: Thick Film; Packaging: Tape and Reel; Termination: SMD/SMT; Military Standard: Not; Voltage Rating (DC): 50V; Working Voltage: 50V; Number of Terminations: 2; Length: 1mm; Depth: 0.5mm; Radiation Hardening: No; REACH SVHC: No SVHC; Lead Free: Lead Free; Supplier Part Number 1: 67R9960; Supplier 2: Future Electronics; Supplier 3: Mouser; Supplier 4: Element14; Supplier Part Number 2: RC0402FR-1310KL-CUTT; Supplier Part Number 3: 603-RC0402FR-1310KL; Supplier Part Number 4: 1799235
R36 = CRCW06030000Z0EA: RES SMD 0 OHM JUMPER 1/10W 0603 0 Ohms Jumper 0.1W, 1/10W Chip Resistor 0603 (1608 Metric) Automotive AEC-Q200 Thick Film; Manufacturer 1: Vishay; Manufacturer Part Number 1: CRCW0603-0000Z0EA; Resistance: 0mR; Power Rating: 100mW; Voltage Rating: 75V; Temperature Coefficient: 100ppm/°C; Tolerance: 5%; Current Rating: 2A; Supplier 1: Digi-Key; Stock 1: 742743; Pricing 1: 1=0.100000, 10=0.034000, 25=0.024400, 50=0.018600, 100=0.013800, 250=0.010480, 500=0.008400, 1000=0.006180 (USD); RoHS: Yes; Mount: Surface Mount; Case/Package: 0603; Weight: 7.1E-05oz; Contact Plating: Tin,Lead; Case Code (Metric): 1608; Case Code (Imperial): 0603; Min Operating Temperature: -55°C; Max Operating Temperature: 155°C; Composition: Thick Film; Termination: SMD/SMT; Packaging: Tape and Reel; Package Quantity: 1; Number of Terminations: 2; Military Standard: Not; Max Power Dissipation: 100mW; Voltage Rating (DC): 75V; Features: Automotive AEC-Q200; Working Voltage: 75V; Length: 1.55mm; Height: 0.02inch; Width: 0.033inch; Depth: 0.85mm; Radiation Hardening: No; Lead Free: Lead Free; REACH SVHC: Unknown; ComponentLink1URL: https://datasheet.ciiva.com/2461/dcrcwe3-2461968.pdf?src-supplier=Digi-Key; ComponentLink1Description: https://datasheet.ciiva.com/2461/dcrcwe3-2461968.pdf?src-supplier=Digi-Key; ComponentLink2URL: https://datasheet.ciiva.com/2461/dcrcwe3-2461969.pdf?src-supplier=Digi-Key; ComponentLink2Description: https://datasheet.ciiva.com/2461/dcrcwe3-2461969.pdf?src-supplier=Digi-Key; ComponentLink3URL: https://datasheet.ciiva.com/2461/dcrcwe3-2461970.pdf?src-supplier=Digi-Key; ComponentLink3Description: https://datasheet.ciiva.com/2461/dcrcwe3-2461970.pdf?src-supplier=Digi-Key; ComponentLink4URL: https://datasheet.ciiva.com/8340/dcrcwe3-8340197.pdf?src-supplier=Avnet; ComponentLink4Description: https://datasheet.ciiva.com/8340/dcrcwe3-8340197.pdf?src-supplier=Avnet; ComponentLink5URL: https://datasheet.ciiva.com/16941/dcrcw-16941302.pdf?src-supplier=Avnet+Europe; ComponentLink5Description: https://datasheet.ciiva.com/16941/dcrcw-16941302.pdf?src-supplier=Avnet+Europe; ComponentLink6URL: https://datasheet.ciiva.com/16199/dcrcwe3-16199063.pdf?src-supplier=Future+Electronics; ComponentLink6Description: https://datasheet.ciiva.com/16199/dcrcwe3-16199063.pdf?src-supplier=Future+Electronics; ComponentLink7URL: https://datasheet.ciiva.com/16725/70201119-16725175.pdf?src-supplier=Allied+Electronics; ComponentLink7Description: https://datasheet.ciiva.com/16725/70201119-16725175.pdf?src-supplier=Allied+Electronics; ComponentLink8URL: https://datasheet.ciiva.com/26316/fld-crcw-e3-data-en-26316615.pdf?src-supplier=Distrelec; ComponentLink8Description: https://datasheet.ciiva.com/26316/fld-crcw-e3-data-en-26316615.pdf?src-supplier=Distrelec; ComponentLink9URL: https://datasheet.ciiva.com/5544/dcrcwe3-109170-5544344.pdf?src-supplier=Mouser; ComponentLink9Description: https://datasheet.ciiva.com/5544/dcrcwe3-109170-5544344.pdf?src-supplier=Mouser; ComponentLink10URL: https://datasheet.ciiva.com/7841/1720486-7841816.pdf?src-supplier=Element14; ComponentLink10Description: https://datasheet.ciiva.com/7841/1720486-7841816.pdf?src-supplier=Element14; ComponentLink11URL: https://datasheet.ciiva.com/7841/1720486-7841817.pdf?src-supplier=Element14; ComponentLink11Description: https://datasheet.ciiva.com/7841/1720486-7841817.pdf?src-supplier=Element14; ComponentLink12URL: https://datasheet.ciiva.com/7841/125364-7841818.pdf?src-supplier=Element14; ComponentLink12Description: https://datasheet.ciiva.com/7841/125364-7841818.pdf?src-supplier=Element14; ComponentLink13URL: https://datasheet.ciiva.com/16721/70201119-16721450.pdf?src-supplier=Allied+Electronics; ComponentLink13Description: https://datasheet.ciiva.com/16721/70201119-16721450.pdf?src-supplier=Allied+Electronics; Supplier Part Number 1: 541-0.0GCT-ND
R37 R38 = RC0402FR-072K2L: RES SMD 2.2K OHM 1% 1/16W 0402; Manufacturer 1: Yageo; Resistance: 2.2kR; Temperature Coefficient: 100ppm/°C; Power Rating: 63mW; Voltage Rating: 50V; Supplier 1: Digi-Key; Manufacturer Part Number 1: RC0402FR-072K2L; Stock 1: 12579098; Pricing 1: 1=0.10000, 10=0.01600, 100=0.00640, 1000=0.00289, 2500=0.00251, 5000=0.00207 (USD); RoHS: Yes; Case/Package: 0402; Weight: 2.3E-05oz; Case Code (Imperial): 0402; Case Code (Metric): 1005; Min Operating Temperature: -55°C; Max Operating Temperature: 155°C; Packaging: Tape and Reel; Tolerance: 1%; Composition: Thick Film; Termination: SMD/SMT; Military Standard: Not; Length: 1mm; Height: 0.35mm; Width: 0.5mm; Depth: 0.5mm; Lead Free: Lead Free; REACH SVHC: Unknown; ComponentLink1URL: https://datasheet.ciiva.com/11808/0900766b80c66297-11808786.pdf?src-supplier=RSComponents; ComponentLink1Description: https://datasheet.ciiva.com/11808/0900766b80c66297-11808786.pdf?src-supplier=RSComponents; ComponentLink2URL: https://datasheet.ciiva.com/12577/pyu-rc0402-51-rohs-l-6-r-12577429.pdf?src-supplier=Mouser; ComponentLink2Description: https://datasheet.ciiva.com/12577/pyu-rc0402-51-rohs-l-6-r-12577429.pdf?src-supplier=Mouser; ComponentLink3URL: https://datasheet.ciiva.com/16741/pyu-rc0402-51-rohs-l-6-r-16741015.pdf?src-supplier=Future+Electronics; ComponentLink3Description: https://datasheet.ciiva.com/16741/pyu-rc0402-51-rohs-l-6-r-16741015.pdf?src-supplier=Future+Electronics; ComponentLink4URL: https://datasheet.ciiva.com/7983/1018594-7983515.pdf?src-supplier=Element14; ComponentLink4Description: https://datasheet.ciiva.com/7983/1018594-7983515.pdf?src-supplier=Element14; ComponentLink5URL: https://datasheet.ciiva.com/46383/1018594-46383563.pdf?src-supplier=Element14; ComponentLink5Description: https://datasheet.ciiva.com/46383/1018594-46383563.pdf?src-supplier=Element14; ComponentLink6URL: https://datasheet.ciiva.com/7849/1018594-7849928.pdf?src-supplier=Element14; ComponentLink6Description: https://datasheet.ciiva.com/7849/1018594-7849928.pdf?src-supplier=Element14; ComponentLink7URL: https://datasheet.ciiva.com/7849/1018594-7849929.pdf?src-supplier=Element14; ComponentLink7Description: https://datasheet.ciiva.com/7849/1018594-7849929.pdf?src-supplier=Element14; Supplier 2: Mouser; Supplier 3: Newark; Supplier Part Number 1: 311-2.20KLRCT-ND; Supplier Part Number 2: 603-RC0402FR-072K2L; Supplier Part Number 3: 98K7523
TP26 = TEST_POINT
U12 = BNO085: IMU ACCEL/GYRO/MAG I2C 32BIT; Manufacturer 1: Hillcrest Laboratories; Sensor Type: Accelerometer,Gyroscope,Magnetometer; Output Type: SPI,I2C; Supplier 1: Digi-Key; Manufacturer Part Number 1: BNO085; RoHS: No; Category: Inertial Measurement Units (IMUs); Stock 1: 11593; Pricing 1: 1=11.85000, 5=10.31200, 10=9.28100, 25=8.25000, 50=7.63120, 100=6.60000, 500=6.18750, 1000=5.77500 (USD); Mount: Surface Mount; Case/Package: LGA; Min Operating Temperature: -40°C; Max Operating Temperature: 85°C; Packaging: Tape and Reel; ComponentLink1URL: https://www.hillcrestlabs.com/downloads/bno080-datasheet?src-supplier=Digi-Key; ComponentLink1Description: https://www.hillcrestlabs.com/downloads/bno080-datasheet?src-supplier=Digi-Key; ComponentLink2URL: https://www.hillcrestlabs.com/downloads/bno080-migration-guide?src-supplier=Digi-Key; ComponentLink2Description: https://www.hillcrestlabs.com/downloads/bno080-migration-guide?src-supplier=Digi-Key; Supplier Part Number 1: 1888-1006-1-ND
Y1 = ABS06-127-32.768KHZ-T: CRYSTAL 32.768kHz ±20ppm Crystal 12.5pF 90 kOhms 2-SMD, No Lead; Manufacturer 1: Abracon; ESR (Equivalent Series Resistance): 90kR; Supplier 1: Digi-Key; Manufacturer Part Number 1: ABS06-127-32.768KHZ-T; RoHS: Yes; Stock 1: 1640; Pricing 1: 1=0.69000, 10=0.60700, 50=0.56760, 100=0.50160, 500=0.47520, 1000=0.39600 (USD); Mount: Surface Mount; Case/Package: SMD/SMT; Min Operating Temperature: -40°C; Max Operating Temperature: 85°C; Packaging: Tape and Reel; ComponentLink1URL: http://www.farnell.com/datasheets/2614114.pdf?src-supplier=Farnell; ComponentLink1Description: http://www.farnell.com/datasheets/2614114.pdf?src-supplier=Farnell; ComponentLink2URL: https://abracon.com/datasheets/ABS06-127-32.768kHz-T.pdf?src-supplier=Digi-Key; ComponentLink2Description: https://abracon.com/datasheets/ABS06-127-32.768kHz-T.pdf?src-supplier=Digi-Key; ComponentLink3URL: http://www.farnell.com/datasheets/2614114.pdf?src-supplier=Newark; ComponentLink3Description: http://www.farnell.com/datasheets/2614114.pdf?src-supplier=Newark; Supplier 2: Digi-Key; Supplier 3: Mouser; Supplier 4: Verical; Supplier Part Number 1: 535-14513-1-ND; Supplier Part Number 2: 535-14513-6-ND; Supplier Part Number 3: 815-ABS0612732.768KT; Supplier Part Number 4: ABS06-127-32.768KHZ-T